# Altium schematic sheet Block Diagram.SchDoc: Block Diagram
size A3; Date: <Fecha>; CheckedBy: <>; DrawnBy: <>; Organization: Bizintek Innova S.L.; Revision: V2; SheetNumber: 1; SheetTotal: 3; PageSetup: Record=PageOptions|CenterHorizontal=True|CenterVertical=True|PrintScale=1.00|XCorrection=1.00|YCorrection=1.00|PrintKind=0|BorderSize=5000000|LeftOffset=0|BottomOffset=0|Orientation=2|PaperLength=1000|PaperWidth=1000|Scale=100|PaperSource=7|PrintQuality=-3|MediaType=1|DitherType=10|PrintScaleMode=0|PaperKind=A4|PaperIndex=9; ProjectName: <Nombre Proyecto>
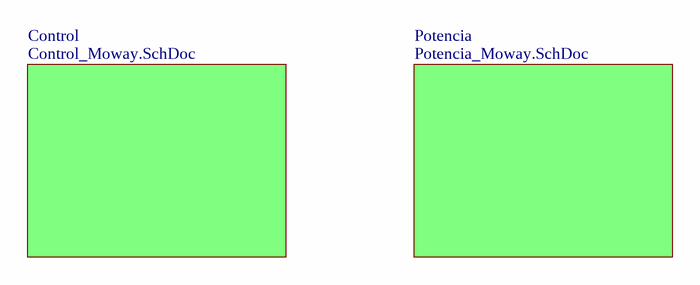
[diagram p0: Block Diagram.SchDoc]

## Sub-sheets
Control = Control_Moway.SchDoc: no entries
Potencia = Potencia_Moway.SchDoc: no entries

## Notes on the sheet
- Project:
- Revision:
- Author:
- Library Version:
- Sheet:
- of